# Altium schematic sheet 555wire.SchDoc
size A4
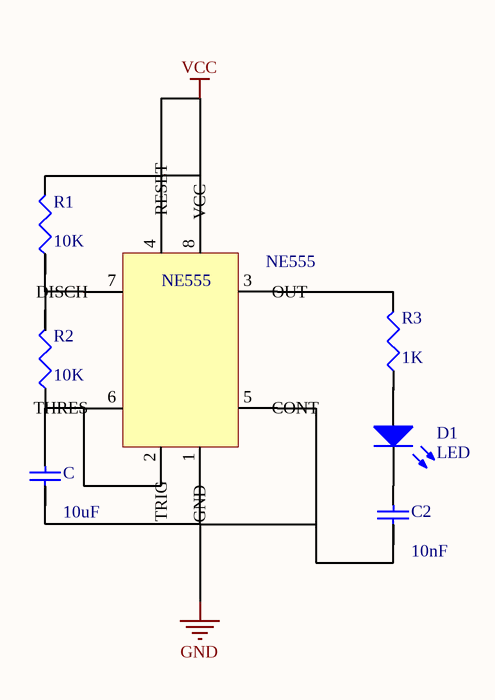
[diagram p0: 555wire.SchDoc]

## Parts
?  NE555
C  value 10uF  [C1206]  (hidden comment: Cap Semi)
C2  value 10nF  [C1206]  (hidden comment: Cap Semi)
D1  LED  [LED-0]
R1  value 10K  [J1-0603]  (hidden comment: Res3)
R2  value 10K  [J1-0603]  (hidden comment: Res3)
R3  value 1K  [J1-0603]  (hidden comment: Res3)

## Nets
NetC2_2: C2.2 D1.2(K)

Not connected (* = marked no-connect by the designer): ? 1(GND) 2(TRIG) 3(OUT) 4(RESET) 5(CONT) 6(THRES) 7(DISCH) 8(VCC); C 1 2; C2 1; D1 1(A); R1 1 2; R2 1 2; R3 1 2

## Notes on the sheet
- Labels drawn without touching a wire or pin: GND, VCC

## Library data of the parts
? = NE555: IC OSC SINGLE TIMER 100KHZ 8-DIP; NE555: *
C C2 = Cap Semi: Capacitor (Semiconductor SIM Model); Published: 8-Jun-2000; LatestRevisionDate: 29-May-2009; LatestRevisionNote: IPC-7351 Footprint Added.; PackageReference: C1206; Publisher: Altium Limited; PackageDescription: Chip Capacitor
D1 = LED0: Typical INFRARED GaAs LED; Published: 8-Jun-2000; LatestRevisionDate: 08-Jul-2005; LatestRevisionNote: Mech Layer 1 removed.; PackageReference: LED-0; Publisher: Altium Limited; PackageDescription: LED; 2 Leads
R1-R3 = Res3: Resistor; Published: 8-Jun-2000; LatestRevisionDate: 29-May-2009; LatestRevisionNote: IPC-7351 Footprint Added.; PackageReference: J1-0603; Publisher: Altium Limited; PackageDescription: Chip Resistor